# Altium schematic sheet DecaWave.SchDoc
size A
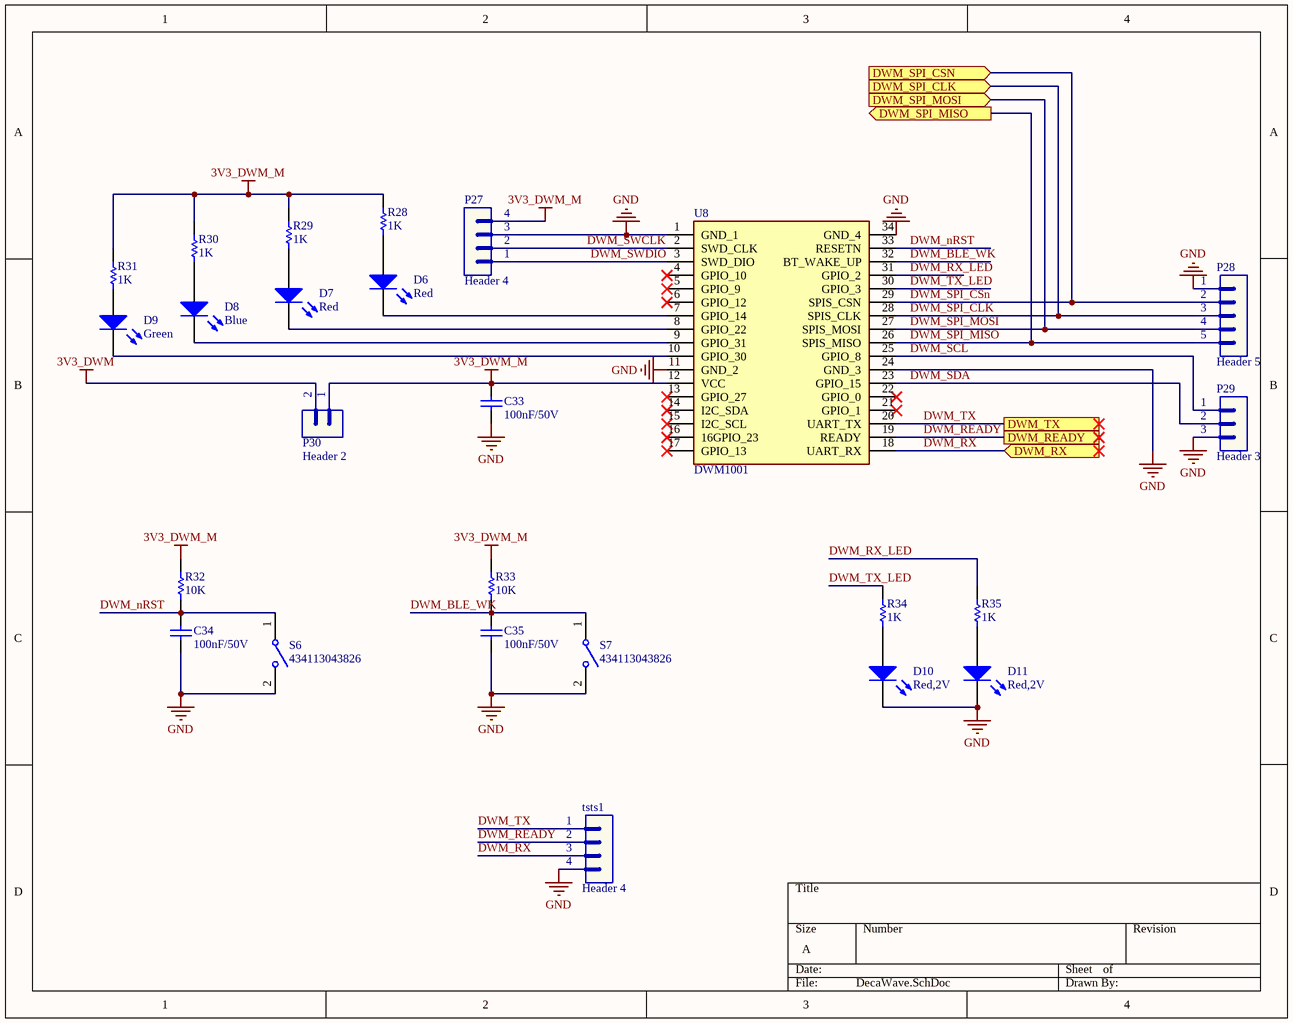
[diagram p0: DecaWave.SchDoc]

## Parts
C33  value 100nF/50V  [CAP-SM-0805]  (hidden comment: Cap-1nF-50V-0805)
C34  value 100nF/50V  [CAP-SM-0805]  (hidden comment: Cap-4.7uF-50V-0805)
C35  value 100nF/50V  [CAP-SM-0805]  (hidden comment: Cap-4.7uF-50V-0805)
D6  value Red  [LED-3mm]  (hidden comment: LED-RED-TH-3mm)
D7  value Red  [LED-3mm]  (hidden comment: LED-RED-TH-3mm)
D8  value Blue  [LED-3mm]  (hidden comment: LED-BLUE-TH-3mm)
D9  value Green  [LED-3mm]  (hidden comment: LED-GREEN-TH-3mm)
D10  value Red,2V  [LED-3mm]  (hidden comment: LED-RED-TH-3mm)
D11  value Red,2V  [LED-3mm]  (hidden comment: LED-RED-TH-3mm)
P27  Header 4  [JP4]
P28  Header 5  [JP5]
P29  Header 3  [JP3]
P30  Header 2  [JP2]
R28  value 1K  [RES-SM-0805]  (hidden comment: Res-0-0805)
R29  value 1K  [RES-SM-0805]  (hidden comment: Res-0-0805)
R30  value 1K  [RES-SM-0805]  (hidden comment: Res-0-0805)
R31  value 1K  [RES-SM-0805]  (hidden comment: Res-0-0805)
R32  value 10K  [RES-SM-0805]  (hidden comment: Res-1K-0805)
R33  value 10K  [RES-SM-0805]  (hidden comment: Res-1K-0805)
R34  value 1K  [RES-SM-0805]  (hidden comment: Res-1K-0805)
R35  value 1K  [RES-SM-0805]  (hidden comment: Res-1K-0805)
S6  434113043826  [434113043826]
S7  434113043826  [434113043826]
tsts1  Header 4  [JP4]
U8  DWM1001  [DWM1001]

## Ports
DWM_READY, DWM_RX (in), DWM_SPI_CLK (in), DWM_SPI_CSN (in), DWM_SPI_MISO (out), DWM_SPI_MOSI (in), DWM_TX

## Nets
3V3_DWM: P30.2
3V3_DWM_M: C33.2 P27.4 P30.1 R28.2 R29.2 R30.2 R31.1 R32.2 R33.2 U8.12(VCC)
GND: C33.1 C34.1 C35.1 D10.2(K) D11.2(K) P27.3 P28.1 P29.3 S6.2 S7.2 tsts1.4 U8.1(GND_1) U8.11(GND_2) U8.24(GND_3) U8.34(GND_4)
DWM_BLE_WK: C35.2 R33.1 S7.1 U8.32(BT_WAKE_UP)
DWM_nRST: C34.2 R32.1 S6.1 U8.33(RESETN)
DWM_READY: tsts1.2 U8.19(READY) ; port DWM_READY
DWM_RX: tsts1.3 U8.18(UART_RX) ; port DWM_RX
DWM_RX_LED: R35.2 U8.31(GPIO_2)
DWM_SCL: P29.1 U8.25(GPIO_8)
DWM_SDA: P29.2 U8.23(GPIO_15)
DWM_SPI_CLK: P28.3 U8.28(SPIS_CLK) ; port DWM_SPI_CLK
DWM_SPI_CSn: P28.2 U8.29(SPIS_CSN) ; port DWM_SPI_CSN
DWM_SPI_MISO: P28.5 U8.26(SPIS_MISO) ; port DWM_SPI_MISO
DWM_SPI_MOSI: P28.4 U8.27(SPIS_MOSI) ; port DWM_SPI_MOSI
DWM_SWCLK: P27.2 U8.2(SWD_CLK)
DWM_SWDIO: P27.1 U8.3(SWD_DIO)
DWM_TX: tsts1.1 U8.20(UART_TX) ; port DWM_TX
DWM_TX_LED: R34.2 U8.30(GPIO_3)
NetD6_1: D6.1(A) R28.1
NetD6_2: D6.2(K) U8.7(GPIO_14)
NetD7_1: D7.1(A) R29.1
NetD7_2: D7.2(K) U8.8(GPIO_22)
NetD8_1: D8.1(A) R30.1
NetD8_2: D8.2(K) U8.9(GPIO_31)
NetD9_2: D9.2(K) U8.10(GPIO_30)
NetD10_1: D10.1(A) R34.1
NetD11_1: D11.1(A) R35.1

Not connected (* = marked no-connect by the designer): D9 1(A); R31 2; U8 4(GPIO_10)* 5(GPIO_9)* 6(GPIO_12)* 13(GPIO_27)* 14(I2C_SDA)* 15(I2C_SCL)* 16(16GPIO_23)* 17(GPIO_13)* 21(GPIO_1)* 22(GPIO_0)*

## Library data of the parts
C33 = Cap-1nF-50V-0805: CAP CER 1000PF 100V X7R 0805; Manufacturer: Johanson Dielectrics Inc.; Manufacturer Part Number: 101X15W102MV4E; Local Supplier: thegioiic; Local Supplier Link: https://thegioiic.com/products/tu-1nf-50v-0805; Supplier 1: Digikey; Supplier 1 Link: https://www.digikey.com/product-detail/en/johanson-dielectrics-inc/101X15W102MV4E/709-1335-1-ND/2327235; Supplier 1 Part Number: 709-1335-1-ND
C34 C35 = Cap-4.7uF-50V-0805: CAP CER 4.7UF 50V X5R 0805; Manufacturer: Murata Electronics; Manufacturer Part Number: GRM21BR61H475KE51L; Local Supplier: thegioiic; Local Supplier Link: https://thegioiic.com/products/tu-4-7uf-50v-0805-cap; Supplier 1: Digikey; Supplier 1 Link: https://www.digikey.com/product-detail/en/murata-electronics/GRM21BR61H475KE51L/490-10751-1-ND/5251349; Supplier 1 Part Number: 490-10751-1-ND
D6 D7 D10 D11 = LED-RED-TH-3mm: LED RED CLEAR T-1 T/H; Manufacturer: Kingbright; Manufacturer Part Number: WP710A10SEC/J3; Local Supplier: thegioiic; Local Supplier Link: https://thegioiic.com/products/led-do-3mm-chan-dai; Supplier 1: Digikey; Supplier 1 Link: https://www.digikey.com/product-detail/en/kingbright/WP710A10SEC-J3/754-1589-ND/2769815; Supplier 1 Part Number: 754-1589-ND
D8 = LED-BLUE-TH-3mm: LED BLUE CLEAR T-1 T/H; Manufacturer: Kingbright; Manufacturer Part Number: WP710A10QBC/D; Local Supplier: thegioiic; Local Supplier Link: https://thegioiic.com/products/led-xanh-duong-3mm-chan-dai; Supplier 1: Digikey; Supplier 1 Link: https://www.digikey.com/product-detail/en/kingbright/WP710A10QBC-D/754-1596-ND/2769812; Supplier 1 Part Number: 754-1596-ND
D9 = LED-GREEN-TH-3mm: LED GREEN CLEAR T-1 T/H; Manufacturer: Kingbright; Manufacturer Part Number: WP710A10ZGC/G; Local Supplier: thegioiic; Local Supplier Link: https://thegioiic.com/products/led-xanh-la-3mm-chan-dai; Supplier 1: Digikey; Supplier 1 Link: https://www.digikey.com/product-detail/en/kingbright/WP710A10ZGC-G/754-1612-ND/2769684; Supplier 1 Part Number: 754-1612-ND
P27 tsts1 = Header 4: Header, 4-Pin; LatestRevisionDate: 17-Jul-2002; LatestRevisionNote: Re-released for DXP Platform.; Publisher: Altium Limited
P28 = Header 5: Header, 5-Pin; LatestRevisionDate: 17-Jul-2002; LatestRevisionNote: Re-released for DXP Platform.; Publisher: Altium Limited
P29 = Header 3: Header, 3-Pin; LatestRevisionDate: 17-Jul-2002; LatestRevisionNote: Re-released for DXP Platform.; Publisher: Altium Limited
P30 = Header 2: Header, 2-Pin; LatestRevisionDate: 17-Jul-2002; LatestRevisionNote: Re-released for DXP Platform.; Publisher: Altium Limited
R28-R31 = Res-0-0805: RES 0 OHM JUMPER 0805; Manufacturer: Vishay Dale; Manufacturer Part Number: WSL080500000ZEA9; Local Supplier: thegioiic; Local Supplier Link: https://thegioiic.com/products/dien-tro-0-ohm-0805-5; Supplier 1: Digikey; Supplier 1 Link: https://www.digikey.com/product-detail/en/vishay-dale/WSL080500000ZEA9/541-3928-1-ND/7423223; Supplier 1 Part Number: 541-3928-1-ND
R32-R35 = Res-1K-0805: RES 1K OHM 1% 1/4W 0805; Manufacturer: Stackpole Electronics Inc; Manufacturer Part Number: RNCP0805FTD1K00; Local Supplier: thegioiic; Local Supplier Link: https://thegioiic.com/products/dien-tro-1k-ohm-0805-5; Supplier 1: Digikey; Supplier 1 Link: https://www.digikey.com/product-detail/en/stackpole-electronics-inc/RNCP0805FTD1K00/RNCP0805FTD1K00CT-ND/2240568; Supplier 1 Part Number: RNCP0805FTD1K00CT-ND
S6 S7 = 434113043826: WS-TASV J-Bend SMT Tact Switch 6x3.5mm, height 4.3mm, 260gf; Rated Voltage: 12VDC; Rated Current: 50mA; Washable: No; ComponentLink1Description: Manufacturer; ComponentLink1URL: http://www.we-online.de; ComponentLink2Description: Datasheet; ComponentLink2URL: https://katalog.we-online.com/em/datasheet/434113043826.pdf; Operating Temperature: -40 to +85degC; Part Number: 434113043826; Published Date: September 2019; Contact Material: Stainless Steel; Height: 4.3mm; Mounting Technology: SMT; Contact Plating: Silver; Operation Force: 260gf; Packaging: Tape and Reel; Terminal Material: Copper Alloy; Publisher: Wurth Elektronik; Terminal Plating: Silver
U8 = DWM1001: Manufacturer_Name: Decawave Limited; Datasheet Link: https://www.decawave.com/sites/default/files/dwm1001_datasheet.pdf; Height: 3mm; Manufacturer_Part_Number: DWM1001; Arrow Part Number: DWM1001